# EAGLE schematic Adafruit MPR121 Capacitive Touch Shield Original (EAGLE 6.4)
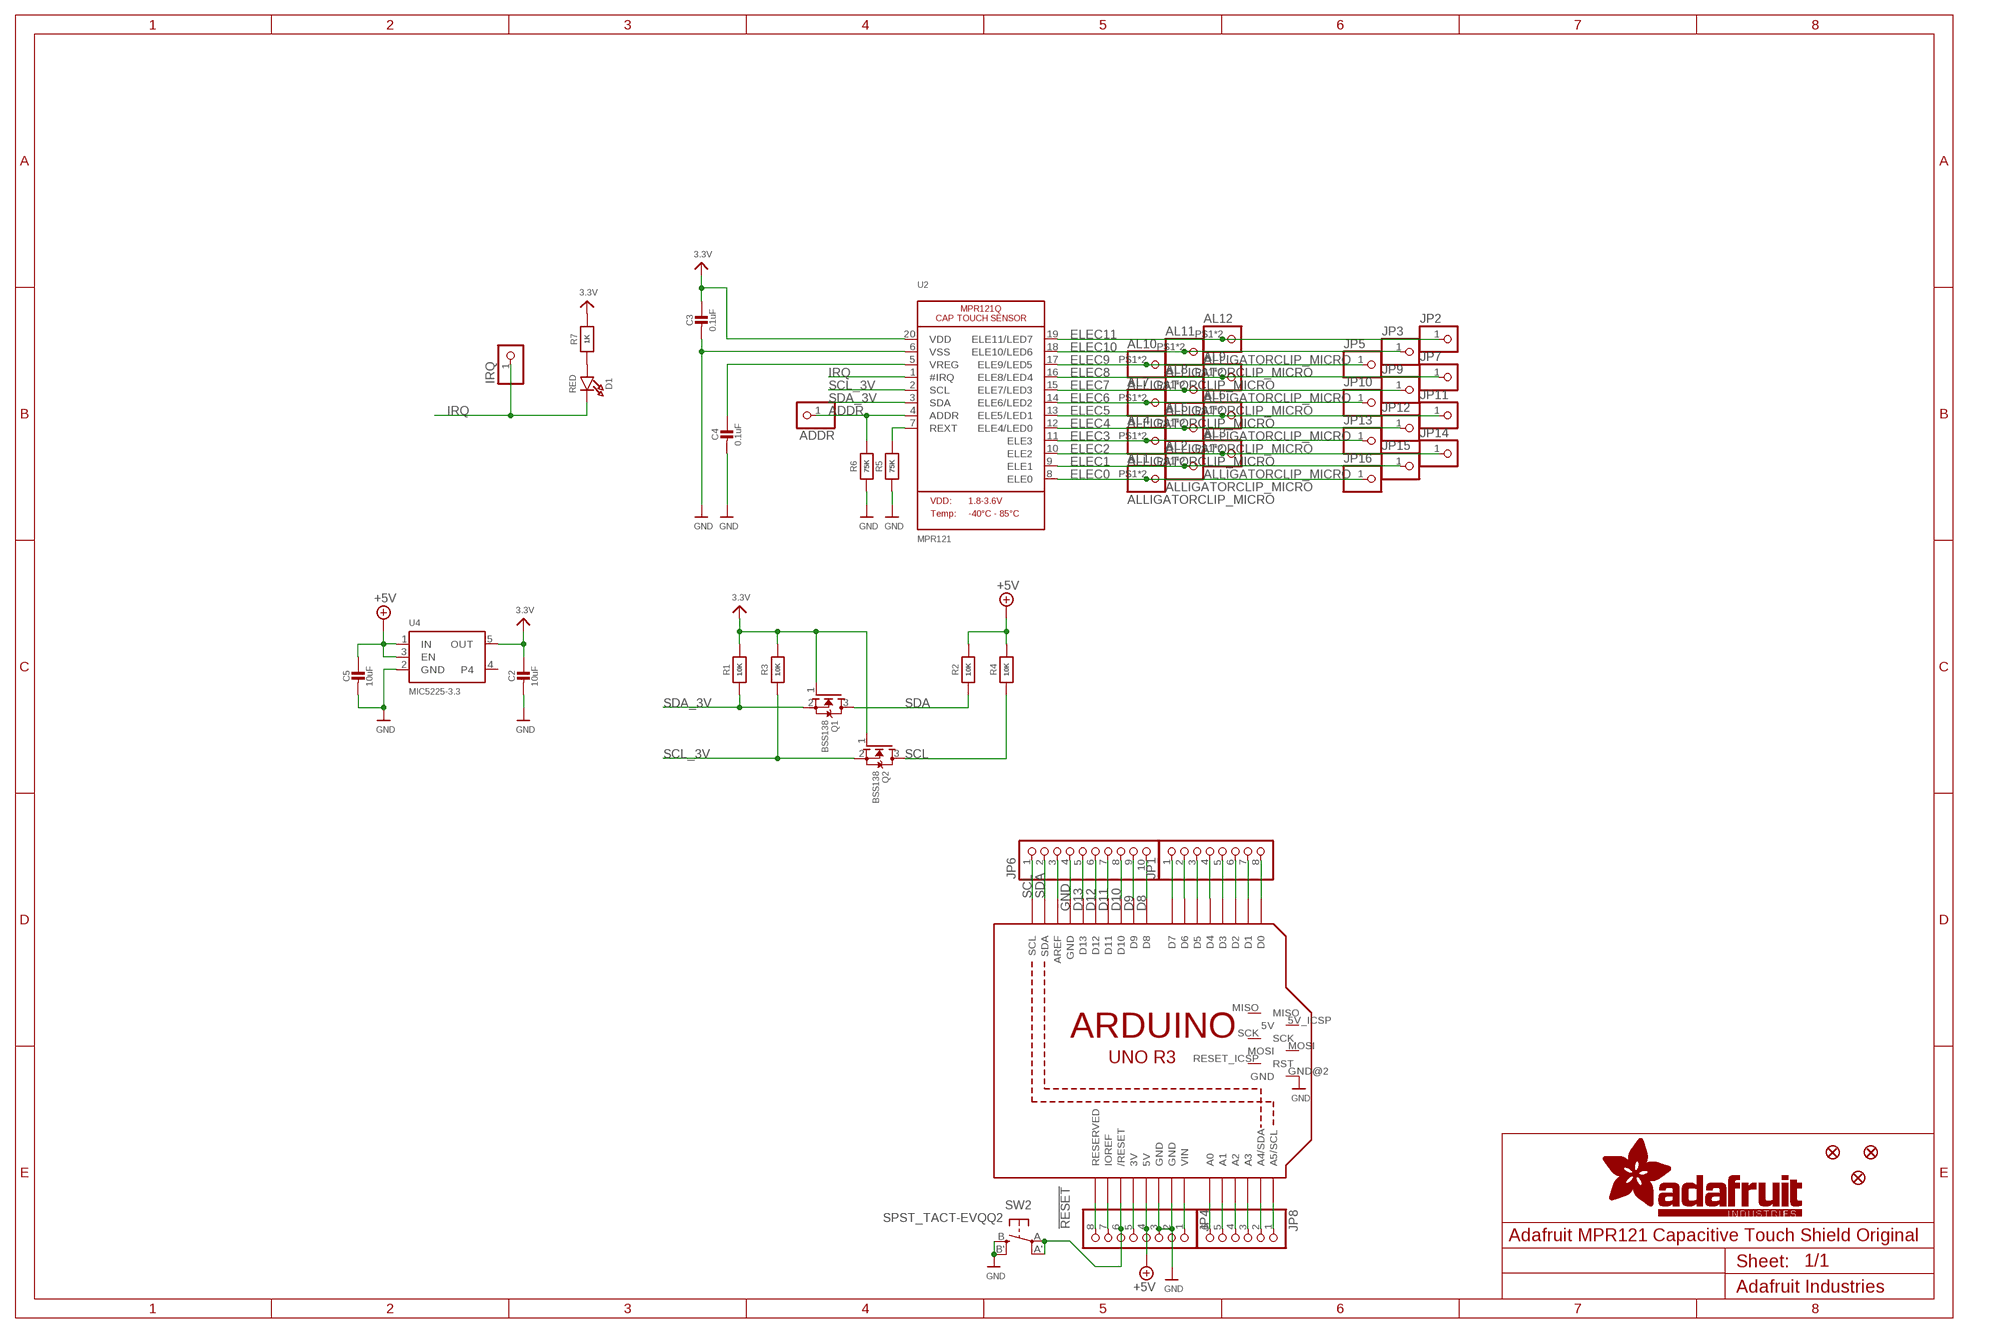
[diagram p0: schematic, sheet 1]

## Parts
ADDR  HEADER-1X1ROUND  [1X01_ROUND]
AL1  ALLIGATORCLIP_MICRO  [ALLIGATORCLIP]
AL2  ALLIGATORCLIP_MICRO  [ALLIGATORCLIP]
AL3  ALLIGATORCLIP_MICRO  [ALLIGATORCLIP]
AL4  ALLIGATORCLIP_MICRO  [ALLIGATORCLIP]
AL5  ALLIGATORCLIP_MICRO  [ALLIGATORCLIP]
AL6  ALLIGATORCLIP_MICRO  [ALLIGATORCLIP]
AL7  ALLIGATORCLIP_MICRO  [ALLIGATORCLIP]
AL8  ALLIGATORCLIP_MICRO  [ALLIGATORCLIP]
AL9  ALLIGATORCLIP_MICRO  [ALLIGATORCLIP]
AL10  ALLIGATORCLIP_MICRO  [ALLIGATORCLIP]
AL11  ALLIGATORCLIP_MICRO  [ALLIGATORCLIP]
AL12  ALLIGATORCLIP_MICRO  [ALLIGATORCLIP]
C2  10uF  CAP_CERAMIC0805-NOOUTLINE  [0805-NO]
C3  0.1uF  CAP_CERAMIC0805-NOOUTLINE  [0805-NO]
C4  0.1uF  CAP_CERAMIC0805-NOOUTLINE  [0805-NO]
C5  10uF  CAP_CERAMIC0805-NOOUTLINE  [0805-NO]
D1  RED  LED0805_NOOUTLINE  [CHIPLED_0805_NOOUTLINE]
FID1  FIDUCIAL""  [FIDUCIAL_1MM]
FID2  FIDUCIAL""  [FIDUCIAL_1MM]
FID3  FIDUCIAL""  [FIDUCIAL_1MM]
IRQ  HEADER-1X1ROUND  [1X01_ROUND]
JP1  PINHD-1X8CLEANBIG  [1X08-CLEANBIG]
JP2  HEADER-1X1ROUND  [1X01_ROUND]
JP3  HEADER-1X1ROUND  [1X01_ROUND]
JP4  PINHD-1X8CLEANBIG  [1X08-CLEANBIG]
JP5  HEADER-1X1ROUND  [1X01_ROUND]
JP6  HEADER-1X1070MIL  [1X10_ROUND70]
JP7  HEADER-1X1ROUND  [1X01_ROUND]
JP8  PINHD-1X6CB  [1X06-CLEANBIG]
JP9  HEADER-1X1ROUND  [1X01_ROUND]
JP10  HEADER-1X1ROUND  [1X01_ROUND]
JP11  HEADER-1X1ROUND  [1X01_ROUND]
JP12  HEADER-1X1ROUND  [1X01_ROUND]
JP13  HEADER-1X1ROUND  [1X01_ROUND]
JP14  HEADER-1X1ROUND  [1X01_ROUND]
JP15  HEADER-1X1ROUND  [1X01_ROUND]
JP16  HEADER-1X1ROUND  [1X01_ROUND]
Q1  BSS138  MOSFET-NWIDE  [SOT23-WIDE]
Q2  BSS138  MOSFET-NWIDE  [SOT23-WIDE]
R1  10K  RESISTOR0805_NOOUTLINE  [0805-NO]
R2  10K  RESISTOR0805_NOOUTLINE  [0805-NO]
R3  10K  RESISTOR0805_NOOUTLINE  [0805-NO]
R4  10K  RESISTOR0805_NOOUTLINE  [0805-NO]
R5  75K  RESISTOR0805_NOOUTLINE  [0805-NO]
R6  75K  RESISTOR0805_NOOUTLINE  [0805-NO]
R7  1K  RESISTOR0805_NOOUTLINE  [0805-NO]
SW2  SPST_TACT-EVQQ2  [EVQ-Q2]
U2  MPR121  MPR121Q  [QFN20_3MM_NOTHERMAL]
U4  MIC5225-3.3  VREG_SOT23-5  [SOT23-5]
U$41  ARDUINO_R3_ICSP  [ARDUINOR3_ICSP]

## Nets
3.3V: C2.1 C3.1 Q1.1(G) Q2.1(G) R1.2 R3.2 R7.2 U2.20(VDD) U4.5(OUT)
!RESET: JP4.6 SW2.A'(P1) SW2.A(P) U$41.RESET(/RESET)
+3V: JP4.5 U$41.3V
+5V: C5.1 JP4.4 R2.2 R4.2 U4.1(IN) U4.3(EN) U$41.5V
A0: JP8.6 U$41.A0
A1: JP8.5 U$41.A1
A2: JP8.4 U$41.A2
A3: JP8.3 U$41.A3
A4: JP8.2 U$41.A4(A4/SDA)
A5: JP8.1 U$41.A5(A5/SCL)
ADDR: ADDR.1 R6.2 U2.4(ADDR)
AREF: JP6.3 U$41.AREF
D0: JP1.8 U$41.D0
D1: JP1.7 U$41.D1
D2: JP1.6 U$41.D2
D3: JP1.5 U$41.D3
D4: JP1.4 U$41.D4
D5: JP1.3 U$41.D5
D6: JP1.2 U$41.D6
D7: JP1.1 U$41.D7
D8: JP6.10 U$41.D8
D9: JP6.9 U$41.D9
D10: JP6.8 U$41.D10
D11: JP6.7 U$41.D11
D12: JP6.6 U$41.D12
D13: JP6.5 U$41.D13
ELEC0: AL1.P$1 AL1.P$2 JP16.1 U2.8(ELE0)
ELEC1: AL2.P$1 AL2.P$2 JP15.1 U2.9(ELE1)
ELEC2: AL3.P$1 AL3.P$2 JP14.1 U2.10(ELE2)
ELEC3: AL4.P$1 AL4.P$2 JP13.1 U2.11(ELE3)
ELEC4: AL5.P$1 AL5.P$2 JP12.1 U2.12(ELE4/LED0)
ELEC5: AL6.P$1 AL6.P$2 JP11.1 U2.13(ELE5/LED1)
ELEC6: AL7.P$1 AL7.P$2 JP10.1 U2.14(ELE6/LED2)
ELEC7: AL8.P$1 AL8.P$2 JP9.1 U2.15(ELE7/LED3)
ELEC8: AL9.P$1 AL9.P$2 JP7.1 U2.16(ELE8/LED4)
ELEC9: AL10.P$1 AL10.P$2 JP5.1 U2.17(ELE9/LED5)
ELEC10: AL11.P$1 AL11.P$2 JP3.1 U2.18(ELE10/LED6)
ELEC11: AL12.P$1 AL12.P$2 JP2.1 U2.19(ELE11/LED7)
GND: C2.2 C3.2 C4.2 C5.2 JP4.2 JP4.3 JP6.4 R5.1 R6.1 SW2.B'(S1) SW2.B(S) U2.6(VSS) U4.2(GND) U$41.GND U$41.GND@1(GND) U$41.GND@2(GND) U$41.GND@3(GND)
IORESET: JP4.7 U$41.IOREF
IRQ: D1.C IRQ.1 U2.1(#IRQ)
N$114: C4.1 U2.5(VREG)
N$115: R5.2 U2.7(REXT)
N$116: D1.A R7.1
NC: JP4.8 U$41.RESERVED
SCL: JP6.1 Q2.3(D) R4.1 U$41.SCL
SCL_3V: Q2.2(S) R3.1 U2.2(SCL)
SDA: JP6.2 Q1.3(D) R2.1 U$41.SDA
SDA_3V: Q1.2(S) R1.1 U2.3(SDA)
VIN: JP4.1 U$41.VIN
Unconnected: U4.4 U$41.5V_ICSP(5V) U$41.MISO U$41.MOSI U$41.RESET_ICSP(RST) U$41.SCK

## Library data of the parts
ADDR IRQ JP2 JP3 JP5 JP7 JP9-JP16 = microbuilder:HEADER-1X1: PIN HEADER
AL1-AL12 = microbuilder:ALLIGATORCLIP
C2-C5 = microbuilder:CAP_CERAMIC: Ceramic Capacitors For new designs, use the packages preceded by an '_' character since they are more reliable: The following footprints should be used on most boards: _0402 - Standard footprint for regular board layouts _0603 - Standard footprint for regular board layouts _0805 - Standard footprint for regular board layouts _1206 - Standard footprint for regular board layouts For extremely tight-pitch boards where space is at a premium, the following 'micro-pitch' footprints can be used (smaller pads, no silkscreen outline, etc.): _0402MP - Micro-pitch footprint for very dense/compact boards _0603MP - Micro-pitch footprint for very dense/compact boards _0805MP - Micro-pitch footprint for very dense/compact boards _1206MP - Micro-pitch footprint for very dense/compact boards
D1 = microbuilder:LED: LED 0603 - 0603 Surface Mount Package 2mA: Green LED - Low Power (3.9mcd, 2ma, 1.7Vf) - Digikey: 475-2709-2-ND Orange LED - Low Power (9.8mcd, 2ma, 1.8Vf) - Digikey: 475-1194-2-ND Red LED - Low Power (5mcd, 2ma, 1.8Vf) - Digikey: 475-1195-2-ND Yellow LED - Low Power (7mcd, 2ma, 1.8Vf) - Digikey: 475-1196-2-ND 5mA: Blue LED - Low Power (17mcd, 5ma, 2.9Vf) - Digikey: LNJ937W8CRACT-ND 0805 - 0805 Surface Mount Package 2mA: Red LED (8.8mcd, 2mA, 1.8Vf, Clear) - Low Power [Digikey: 475-2510-1-ND] Green LED (5mcd, 2mA, 1.8Vf, Clear) - Low Power [Digikey: 475-2730-1-ND] Yellow LED (11.3mcd, 2mA, 1.8Vf, Clear) - Low Power [Digikey: 475-2555-1-ND] 20mA: Red LED (104mcd, 20mA, Diffused) - LS R976 [Digikey: 475-1278-6-ND] Red LED (12mcd, 20mA, 2.0Vf, Clear) - APT2012EC [Digikey: 754-1128-1-ND] Green LED (15mcd, 20mA, 2.2Vf, Clear) - APT2012GC [Digikey: 754-1131-1-ND] Orange LED (160mcd, 20mA, 2.1Vf, Clear) - APT2012SECK [Digikey: 754-1130-1-ND] 1206 - 1206 Surface Mount Package Green LED (26mcd, 20mA, Diffused) - LG N971 [Digikey: 475-1407-6-ND] Red LED (15mcd, 20mA, Diffused) - LH N974 [Digikey: 475-1416-6-ND] Cree - Cree High-Power Surface Mount LEDs XPEBWT-L1-0000-00D50 - White 111lm 350mA 2.9Vf 6200K 110° XTEAWT-00-0000-00000LEE3 - White 114lm 350mA 2.85Vf 5000K 115° Everlight - Everlight 45-21 Series Surface Mount LEDs 45-21/QK2C-B2832AC2CB2/2T - Warm White 2000mcd 20mA 3.25Vf 3050K 120° 45-21/LK2C-B38452C4CB2/2T - Nuetral White 2000mcd 20mA 3.25Vf 4150K 120° 45-21/LK2C-B50634C6CB2/2T - Cold White 2200mcd 20mA 3.25Vf 5650K 120° PLCC2 Reverse Mount LS T77K-J1L2-1-0-2-R18-Z - Red 11.25mcd 2mA 1.8Vf 630nm 120° LO T77K-L1M2-24-Z - Orange 19.6mcd 2mA 1.8Vf 606nm 120° LY T77K-K2M1-26-Z - Yellow 15.7mcd 2mA 1.8Vf 587nm 120°
FID1-FID3 = microbuilder:FIDUCIAL: Fiducial Alignment Points Various fiducial points for machine vision alignment.; BOM: EXCLUDE
JP1 JP4 = adafruit:PINHD-1X8: PIN HEADER
JP6 = microbuilder:HEADER-1X10: PIN HEADER
JP8 = adafruit:PINHD-1X6: PIN HEADER
Q1 Q2 = microbuilder:MOSFET-N: N-Channel Mosfet LEGEND VDS: Voltage Drain-Source ID: Drain Current RDS(ON): Drain-Source On-State Resistance VGS(TH): Gate-Source Threshold Voltage CISS: Drain-Source Input Capacitance SOT-23 Name VDS ID RDS(ON) VGS(TH) CISS Order Number 2N7002E 60V 260mA 2.5 Ohm 2.5V @ 250uA 26.7pF @ 25V 2N7002ET1GOSTR-ND BSH103 30V 850mA 400 mOhm 400mV @ 1mA 83pF @ 24V BSH103,235-ND BSS138 60V 320mA 1.6 Ohm 1.5V @ 250uA 50pF @ 10V Mouser: 771-BSS138PW115 DMN2075U-7 20V 4.2A 38 mOhm 1V @ 250 uA 594.3pF @ 10V DMN2075U-7DICT-ND * BSS138 good choice for I2C level-shifting POWERPAK 1212-8 Name VDS ID RDS(ON) VGS(TH) CISS Order Number Si7308DN 60V 6A 58 mOhm 3V @ 250uA 665pF @ 15V SI7308DN-T1-E3CT-ND
R1-R7 = microbuilder:RESISTOR: Resistors For new designs, use the packages preceded by an '_' character since they are more reliable: The following footprints should be used on most boards: _0402 - Standard footprint for regular board layouts _0603 - Standard footprint for regular board layouts _0805 - Standard footprint for regular board layouts _1206 - Standard footprint for regular board layouts For extremely tight-pitch boards where space is at a premium, the following 'micro-pitch' footprints can be used (smaller pads, no silkscreen outline, etc.): _0402MP - Micro-pitch footprint for very dense/compact boards _0603MP - Micro-pitch footprint for very dense/compact boards _0805MP - Micro-pitch footprint for very dense/compact boards _1206MP - Micro-pitch footprint for very dense/compact boards
SW2 = adafruit:SPST_TACT: SMT 6mm switch, EVQQ2 series http://www.ladyada.net/library/eagle
U2 = microbuilder:MPR121Q: MPR121Q - 12 Electrode Cap Touch Sensor Can drive up to 8 LEDs
U4 = microbuilder:VREG_SOT23-5: SOT23-5 Fixed Voltage Regulators Part Current Out V Out V In V Dropout θJA (°C/W) TJ (°C) Digikey Part No. ADP121 150mA 3.3V 3.4-5.5V 0.09V @ 150mA -- -- ADP121-AUJZ33R7CT-ND ADP121 150mA 3.0V 3.1-5.5V 0.09V @ 150mA -- -- ADP121-AUJZ30R7CT-ND ADP122 300mA 3.3V 3.4-5.5V 0.085V @ 300mA -- -- ADP122AUJZ-3.3-R7CT-ND ADP1712 300mA 3.3V 3.5-5.5V 0.17V @ 300mA -- -- ADP1712AUJZ-3.3-R7TR-ND AP7311 (Low Cost) 150mA 3.3V 3.5-6V 0.15V @ 150mA -- -- AP7311-33WG-7DICT-ND LD39015M18R 150mA 1.8V 1.9V-5.5V 0.08V @ 100mA -- -- 497-6977-1-ND LP2985A-33DBVR 150mA 3.3V 3.3-16V 0.28V @ 150mA 206 150 296-18479-1-ND MCP1824T-3302E/OT 300mA 3.3V 3.5V-6V 0.2V @ 300mA -- -- MCP1824T-3302E/OTCT-ND MIC5205-2.5YM5 TR 150mA 2.5V 2.7-16V 0.165V @ 150mA -- -- 576-1257-2-ND MIC5205-3.0YM5 TR 150mA 3.0V 3.2V-16V 0.165V @ 150mA -- -- 576-1258-2-ND MIC5205-3.3YM5 TR 150mA 3.3V 3.5V-16V 0.165V @ 150mA -- -- 576-1259-2-ND TPS780330220 150mA 3.3V+2.2V 3.6-5.5V 250mV Max -- -- 296-23332-1-ND TDA3663/N1,135 100mA 3.3V 3.5-45V 0.18V @ 50mA -- -- 568-5343-1-ND Max operating temp can be calculated using θJA, TJ (max junction temperature), and power in watts. Set the "Maximum Ambient Temperature" until it reaches TJ ("Max Junction Temperature"), which is the absolute limit for safe use of the regulator: Heat Sink Temperature Calculator <http://www.daycounter.com/Calculators/Heat-Sink-Temperature-Calculator.phtml> For example, With 12V source into a 3.3V LP2985 and a 30mA load, we are dissipating (12V-3.3V) * 0.03A = 0.261W. With a θJA of 206 °C/W, a TJ of 150°C, and 261mW we can safely use the chip without a heat sink up to 75°C (=147.1°C Junction Temperature).
U$41 = adafruit:ARDUINO_R3_ICSP